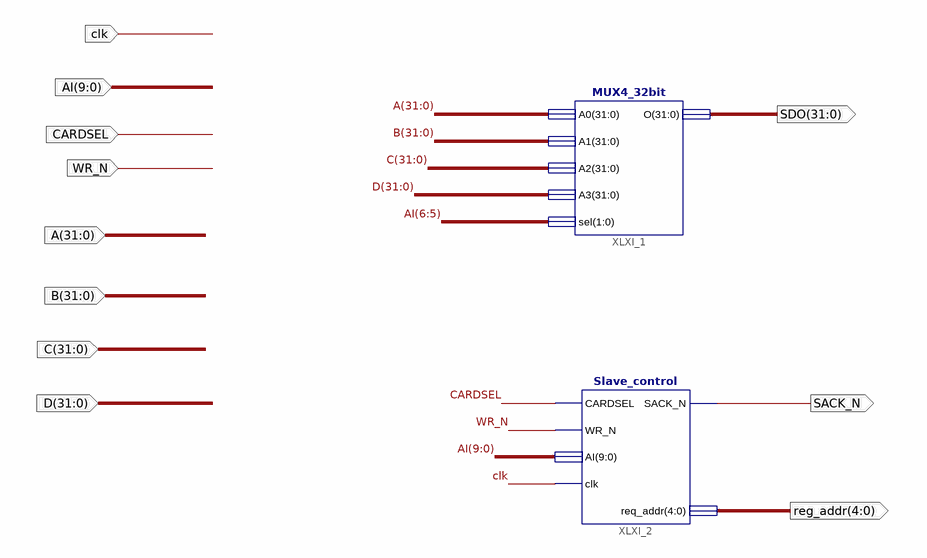
[diagram p0: schematic sheet 1]
// Xilinx ISE schematic Monitor_slave.sch (spartan6) as structural Verilog: 2 symbols, 11 ports
module Monitor_slave (
  input  clk,
  input  [9:0] AI,
  input  CARDSEL,
  input  WR_N,
  input  [31:0] A,
  input  [31:0] B,
  input  [31:0] C,
  input  [31:0] D,
  output [31:0] SDO,
  output SACK_N,
  output [4:0] reg_addr
);

  MUX4_32bit XLXI_1 (.A0(A), .A1(B), .A2(C), .A3(D), .sel(AI[6:5]), .O(SDO));
  Slave_control XLXI_2 (.CARDSEL(CARDSEL), .WR_N(WR_N), .AI(AI), .clk(clk), .SACK_N(SACK_N), .req_addr(reg_addr));
endmodule
